# Altium project SaltBattery.PrjPcb
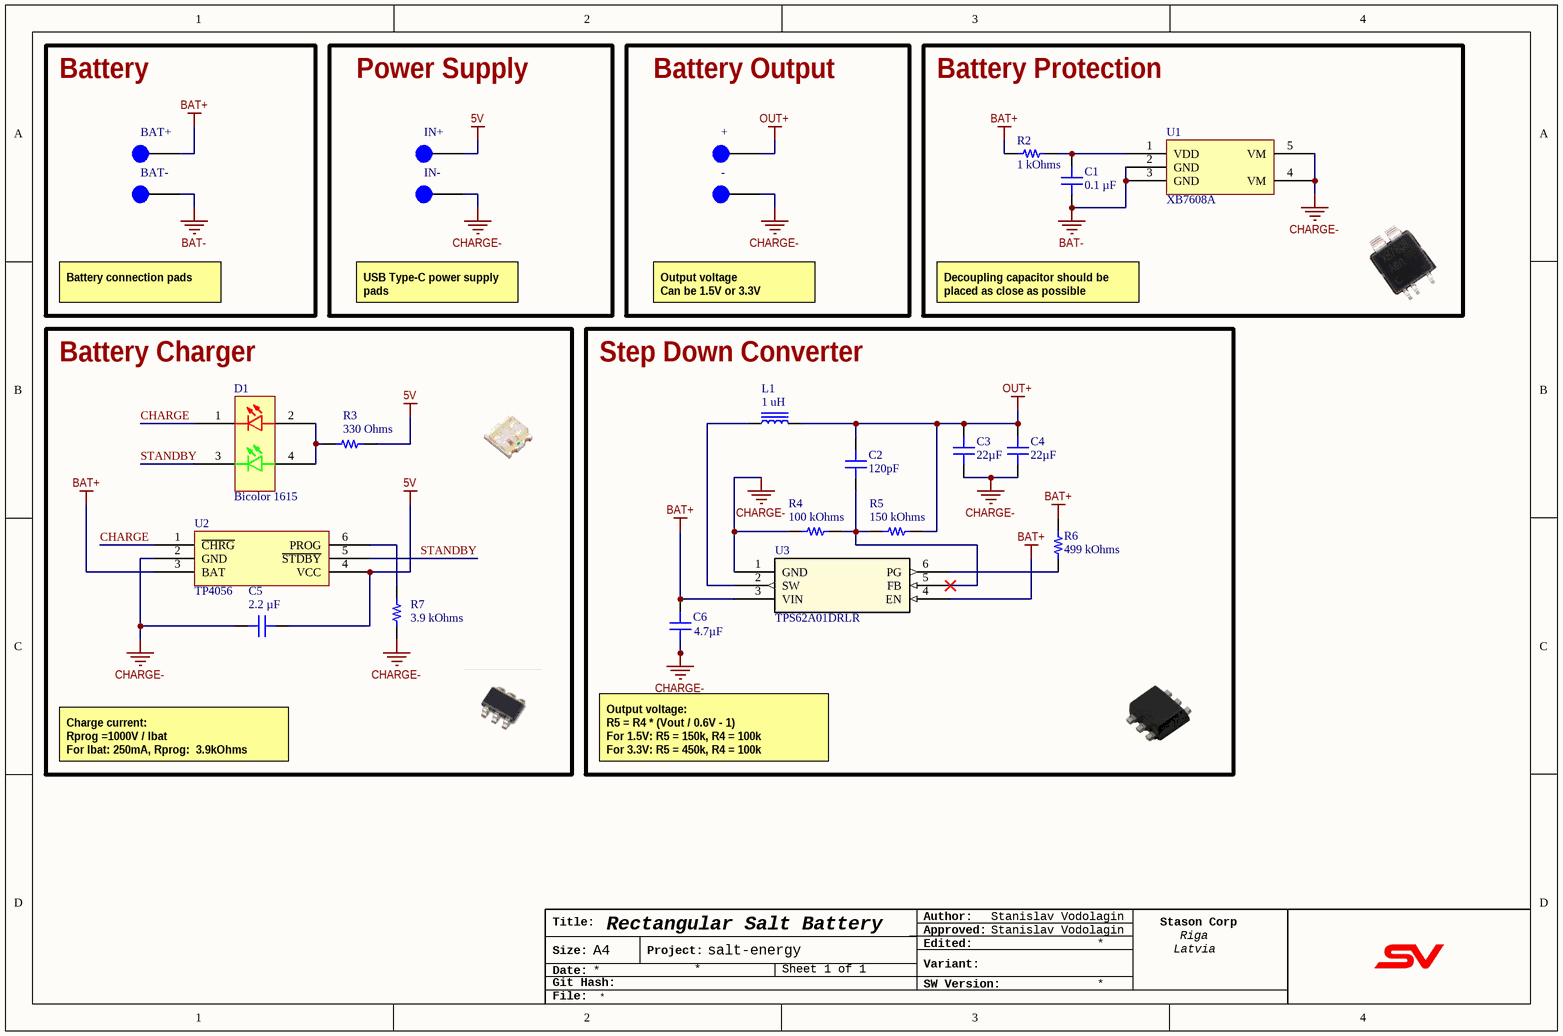
[diagram p0: main.SchDoc]
1 sheet, 23 parts. Net scope: global (net labels, ports and power ports of the same name join across sheets).
Board file: PCB.PcbDoc

## Sheet main.SchDoc: Rectangular Salt Battery
size A4; ApprovedBy: Stanislav Vodolagin; Author: Stanislav Vodolagin; CompanyName: Stason Corp; Organization: Stason Corp; Address1: Riga; Address2: Latvia; SheetNumber: 1; SheetTotal: 1; ProjectTitle: salt-energy

### Parts
+  2MMx2.5MM  [PAD_WITHOUT_HOLE_2X2.5MM]  (value not drawn)  (no BOM)
-  2MMx2.5MM  [PAD_WITHOUT_HOLE_2X2.5MM]  (value not drawn)  (no BOM)
BAT+  2MMx2.5MM  [PAD_WITHOUT_HOLE_2X2.5MM]  (value not drawn)  (no BOM)
BAT-  2MMx2.5MM  [PAD_WITHOUT_HOLE_2X2.5MM]  (value not drawn)  (no BOM)
C1  0.1 µF  [CAP 0805_2012]
C2  120pF  [CAP 0603_1608]
C3  22µF  [CAP 0805_2012]
C4  22µF  [CAP 0805_2012]
C5  2.2 µF  [CAP 0805_2012]
C6  4.7µF  [CAP 0805_2012]
D1  Bicolor 1615  [LED 0603 1615 BICOLOR]
IN+  2MMx2.5MM  [PAD_WITHOUT_HOLE_2X2.5MM]  (value not drawn)  (no BOM)
IN-  2MMx2.5MM  [PAD_WITHOUT_HOLE_2X2.5MM]  (value not drawn)  (no BOM)
L1  1 uH  [TAIYO YUDEN NR4018]
R2  1 kOhms  [RES 0603_1608]
R3  330 Ohms  [RES 0603_1608]
R4  100 kOhms  [RES 0603_1608]
R5  150 kOhms  [RES 0603_1608]
R6  499 kOhms  [RES 0603_1608]
R7  3.9 kOhms  [RES 0603_1608]
U1  XB7608A  [PCB - LEADED - XYSEMI CPC5]
U2  TP4056  [SMD IC SOT-23-6]
U3  TPS62A01DRLR  [TI SOT-563 DRL]

### Blocks framed on the sheet
Battery: BAT+ BAT-
Power Supply: IN+ IN-
Battery Output: + -
Battery Protection: C1 R2 U1
Battery Charger: C5 D1 R3 R7 U2
Step Down Converter: C2-C4 C6 L1 R4-R6 U3

### Nets
5V: C5.2 IN+.1 R3.2 U2.4(VCC)
BAT+: BAT+.1 C6.2 R2.2 R6.2 U2.3(BAT) U3.3(VIN) U3.4(EN)
BAT-: BAT-.1 C1.1 U1.2(GND) U1.3(GND)
CHARGE-: -.1 C3.1 C4.1 C5.1 C6.1 IN-.1 R4.2 R7.1 U1.4(VM) U1.5(VM) U2.2(GND) U3.1(GND)
OUT+: +.1 C2.2 C3.2 C4.2 L1.2 R5.1
CHARGE: D1.1 U2.1(~{CHRG})
STANDBY: D1.3 U2.5(~{STDBY})
NetC1_2: C1.2 R2.1 U1.1(VDD)
NetC2_1: C2.1 R4.1 R5.2 U3.5(FB)
NetD1_2: D1.2 D1.4 R3.1
NetL1_1: L1.1 U3.2(SW)
NetR6_1: R6.1 U3.6(PG)
NetR7_2: R7.2 U2.6(PROG)

### Notes on the sheet
- Battery connection pads
- USB Type-C power supply pads
- Output voltage
  Can be 1.5V or 3.3V
- Decoupling capacitor should be placed as close as possible
- Charge current:
  Rprog =1000V / Ibat
  For Ibat: 250mA, Rprog:  3.9kOhms
- Output voltage:
  R5 = R4 * (Vout / 0.6V - 1)
  For 1.5V: R5 = 150k, R4 = 100k
  For 3.3V: R5 = 450k, R4 = 100k
- Title:
- Author:
- Approved:
- Size:
- Date:
- Git Hash:
- A4
- Project:
- SW Version:
- Variant:
- Edited:
- File:

### Library data of the parts
+ - BAT+ BAT- IN+ IN- = PAD_WITHOUT_HOLE_3X3.5MM: High: 3mm Length: 3.5mm
C1 = VJ0805Y104KFAAT: SMT Capacitor; manufacturer: Vishay Vitramon; id: 199; Temperature Coefficient: X7R; Tolerance: ±10%; Voltage - Rated: 50V; Part Number: VJ0805Y104KFAAT; value: 0.1 µF; Supplier Part Number 1: 720-1753-1-ND; componentlink2description: DigiKey Link; componentlink1url: http://www.vishay.com/docs/45199/vjcommercialseries.pdf; partid: 3420; Supplier 1: DigiKey; series: VJ; lastupdated: 2023-01-03T20:10:53.590; Part Status: Active; Capacitance: 0.1 µF; Device Package: 0805 (2012 Metric); Thickness (Max): 0.057" (1.45mm); Minimum Order: 1; packaging: TapeAndReel; Applications: General Purpose; Package / Case: 0805 (2012 Metric); componentlink1description: Datasheet; price: 0.16; componentlink2url: https://www.digikey.com/en/products/detail/vishay-vitramon/VJ0805Y104KFAAT/8311061; Lifecycle Status: Active; Operating Temperature: -55°C ~ 150°C; Size / Dimension: 0.079" L x 0.049" W (2.00mm x 1.25mm); Mounting Type: Surface Mount, MLCC
C2 = 06031A121KAT2A: SMT Capacitor; manufacturer: AVX Corporation; id: 955; Temperature Coefficient: C0G, NP0; Tolerance: ±10%; Voltage - Rated: 100V; Part Number: 06031A121KAT2A; value: 120pF; Supplier Part Number 1: 478-6023-1-ND; componentlink2description: DigiKey Link; componentlink1url: http://datasheets.avx.com/C0GNP0-Dielectric.pdf; partid: 6218; Supplier 1: DigiKey; series: -; lastupdated: 2020-09-02T01:03:28.977; Part Status: Active; Capacitance: 120pF; Device Package: 0603 (1608 Metric); Thickness (Max): 0.035" (0.90mm); Minimum Order: 1; packaging: TapeAndReel; Applications: General Purpose; Package / Case: 0603 (1608 Metric); componentlink1description: Datasheet; price: 0.04; componentlink2url: http://digikey.com/product-detail/en/avx-corporation/06031A121KAT2A/478-6023-1-ND/2208937; Lifecycle Status: Active; Operating Temperature: -55°C ~ 125°C; Size / Dimension: 0.063" L x 0.032" W (1.60mm x 0.81mm); Mounting Type: Surface Mount, MLCC
C3 C4 = 08056D226KAT2A: SMT Capacitor; manufacturer: AVX Corporation; id: 197; Temperature Coefficient: X5R; Tolerance: ±10%; Voltage - Rated: 6.3V; Part Number: 08056D226KAT2A; value: 22µF; Supplier Part Number 1: 478-10069-1-ND; componentlink2description: DigiKey Link; componentlink1url: http://datasheets.avx.com/cx5r.pdf; partid: 3404; Supplier 1: DigiKey; series: -; lastupdated: 2020-09-02T01:04:40.007; Part Status: Active; Capacitance: 22µF; Device Package: 0805 (2012 Metric); Thickness (Max): 0.060" (1.52mm); Minimum Order: 1; packaging: TapeAndReel; Applications: General Purpose; Package / Case: 0805 (2012 Metric); componentlink1description: Datasheet; price: 0.18; componentlink2url: http://digikey.com/product-detail/en/avx-corporation/08056D226KAT2A/478-10069-1-ND/6564291; Lifecycle Status: Active; Operating Temperature: -55°C ~ 85°C; Size / Dimension: 0.079" L x 0.049" W (2.01mm x 1.25mm); Mounting Type: Surface Mount, MLCC
C5 = GCM21BR71E225KA73K: SMT Capacitor; manufacturer: Murata Electronics; id: 682; Temperature Coefficient: X7R; Tolerance: ±10%; Voltage - Rated: 25V; Part Number: GCM21BR71E225KA73K; value: 2.2 µF; Supplier Part Number 1: 490-14744-1-ND; componentlink2description: DigiKey Link; componentlink1url: https://search.murata.co.jp/Ceramy/image/img/A01X/G101/ENG/GCM21BR71E225KA73-01.pdf; partid: 6110; Supplier 1: DigiKey; series: GCM; lastupdated: 2023-01-03T20:10:47.513; Part Status: Active; Capacitance: 2.2 µF; Device Package: 0805 (2012 Metric); Ratings: AEC-Q200; Thickness (Max): 0.055" (1.40mm); Minimum Order: 1; packaging: TapeAndReel; Applications: Automotive; Package / Case: 0805 (2012 Metric); componentlink1description: Datasheet; price: 0.06; componentlink2url: https://www.digikey.com/en/products/detail/murata-electronics/GCM21BR71E225KA73K/2592259; Lifecycle Status: Active; Operating Temperature: -55°C ~ 125°C; Size / Dimension: 0.079" L x 0.049" W (2.00mm x 1.25mm); Mounting Type: Surface Mount, MLCC
C6 = 0805ZD475KAT2A: SMT Capacitor; manufacturer: AVX Corporation; id: 128; Temperature Coefficient: X5R; Tolerance: ±10%; Voltage - Rated: 10V; Part Number: 0805ZD475KAT2A; value: 4.7µF; Supplier Part Number 1: 478-1415-1-ND; componentlink2description: DigiKey Link; componentlink1url: http://datasheets.avx.com/cx5r.pdf; partid: 3139; Supplier 1: DigiKey; series: -; lastupdated: 2020-09-02T01:04:40.453; Part Status: Active; Capacitance: 4.7µF; Device Package: 0805 (2012 Metric); Thickness (Max): 0.055" (1.40mm); Minimum Order: 1; packaging: TapeAndReel; Applications: General Purpose; Package / Case: 0805 (2012 Metric); componentlink1description: Datasheet; price: 0.12; componentlink2url: http://digikey.com/product-detail/en/avx-corporation/0805ZD475KAT2A/478-1415-1-ND/564447; Lifecycle Status: Active; Operating Temperature: -55°C ~ 85°C; Size / Dimension: 0.079" L x 0.049" W (2.01mm x 1.25mm); Mounting Type: Surface Mount, MLCC
D1 = LED 0603 1615: SMD SMT Light Emitting Diode 1.6*0.8*0.6MM; ComponentLink1Description: Aliexpress; ComponentLink1URL: https://www.aliexpress.com/item/4001174921701.html?spm=a2g0o.order_list.0.0.12d31802vfu5Sp
L1 = NR4018T150M: FIXED IND 1UH 650MA 300MOHM SMD; Manufacturer: Taiyo Yuden; id: 3749; Frequency - Self Resonant: 19MHz; Inductance: 15 µH; Tolerance: ±20%; Type: Drum Core, Wirewound; Inductance Frequency - Test: 100 kHz; Material - Core: Ferrite; DC Resistance (DCR): 300mOhm Max; Value: 15 µH; Shielding: Shielded; Part Number: NR4018T150M; Height - Seated (Max): 0.071" (1.80mm); Supplier Part Number 1: 587-NR4018T150MCT-ND; Current Rating (Amps): 650 mA; ComponentLink1Description: Datasheet; ComponentLink2URL: https://www.digikey.com/en/products/detail/taiyo-yuden/NR4018T150M/1171820; ComponentLink1URL: https://www.yuden.co.jp/productdata/catalog/wound04_e.pdf; Supplier 1: DigiKey; Series: NR; Part Status: Active; ComponentLink2Description: DigiKey Link; Packaging: TapeAndReel; Minimum Order: 1; PartId: 3777; Lifecycle Status: Active; LastUpdated: 2023-01-02T21:11:24.473; Operating Temperature: -25°C ~ 120°C; Size / Dimension: 0.157" L x 0.157" W (4.00mm x 4.00mm); Mounting Type: Surface Mount; Price: 0.13
R2 = ERJ-U3RD1001V: RES 1K OHM 0.5% 1/10W 0603 SMD; Manufacturer: Panasonic Electronic Components; id: 17229; Temperature Coefficient: ±50ppm/°C; Power (Watts): 0.1W, 1/10W; Part Number: ERJ-U3RD1001V; Height - Seated (Max): 0.022" (0.55mm); Supplier Part Number 1: 10-ERJ-U3RD1001VCT-ND; Supplier Device Package: 0603; ComponentLink1Description: Datasheet; ComponentLink2URL: https://www.digikey.com/en/products/detail/panasonic-electronic-components/ERJ-U3RD1001V/12549507; Features: Anti-Sulfur, Automotive AEC-Q200; ComponentLink1URL: https://industrial.panasonic.com/cdbs/www-data/pdf/RDP0000/RDP0000C343.pdf; Composition: Thick Film; Tolerance: ±0.5%; Supplier 1: DigiKey; Series: ERJ-U3R; Part Status: Active; ComponentLink2Description: DigiKey Link; Device Package: 0603 (1608 Metric); Packaging: TapeAndReel; Ratings: AEC-Q200; Minimum Order: 1; Package / Case: 0603 (1608 Metric); PartId: 69166; Lifecycle Status: Active; LastUpdated: 2023-01-02T20:27:49.777; Operating Temperature: -55°C ~ 155°C; Number of Terminations: 2; Value: 1 kOhms; Size / Dimension: 0.063" L x 0.031" W (1.60mm x 0.80mm); Price: 0.03; Resistance: 1 kOhms
R3 = ERA-3AEB331V: RES SMD 330 OHM 0.1% 1/10W 0603; Manufacturer: Panasonic Electronic Components; id: 331; Temperature Coefficient: ±25ppm/°C; Power (Watts): 0.1W, 1/10W; Part Number: ERA-3AEB331V; Height - Seated (Max): 0.022" (0.55mm); Supplier Part Number 1: P330DBCT-ND; Supplier Device Package: 0603; ComponentLink1Description: Datasheet; ComponentLink2URL: https://www.digikey.com/en/products/detail/panasonic-electronic-components/ERA-3AEB331V/1465842; Features: Automotive AEC-Q200; ComponentLink1URL: https://industrial.panasonic.com/cdbs/www-data/pdf/RDM0000/AOA0000C307.pdf; Composition: Thin Film; Tolerance: ±0.1%; Supplier 1: DigiKey; Series: ERA-3A; Part Status: Active; ComponentLink2Description: DigiKey Link; Device Package: 0603 (1608 Metric); Packaging: TapeAndReel; Ratings: AEC-Q200; Minimum Order: 1; Package / Case: 0603 (1608 Metric); PartId: 5565; Lifecycle Status: Active; LastUpdated: 2023-01-02T20:30:24.253; Operating Temperature: -55°C ~ 155°C; Number of Terminations: 2; Value: 330 Ohms; Size / Dimension: 0.063" L x 0.031" W (1.60mm x 0.80mm); Price: 0.03; Resistance: 330 Ohms
R4 = ERJ-U03J104V: RES 100K OHM 5% 1/10W 0603 SMD; Manufacturer: Panasonic Electronic Components; id: 16727; Temperature Coefficient: ±200ppm/°C; Power (Watts): 0.1W, 1/10W; Part Number: ERJ-U03J104V; Height - Seated (Max): 0.022" (0.55mm); Supplier Part Number 1: 10-ERJ-U03J104VCT-ND; Supplier Device Package: 0603; ComponentLink1Description: Datasheet; ComponentLink2URL: https://www.digikey.com/en/products/detail/panasonic-electronic-components/ERJ-U03J104V/11635952; Features: Anti-Sulfur, Automotive AEC-Q200; ComponentLink1URL: https://industrial.panasonic.com/cdbs/www-data/pdf/RDP0000/AOA0000C334.pdf; Composition: Thick Film; Tolerance: ±5%; Supplier 1: DigiKey; Series: ERJ-U03; Part Status: Active; ComponentLink2Description: DigiKey Link; Device Package: 0603 (1608 Metric); Packaging: TapeAndReel; Ratings: AEC-Q200; Minimum Order: 1; Package / Case: 0603 (1608 Metric); PartId: 67627; Lifecycle Status: Active; LastUpdated: 2023-01-02T20:27:56.093; Operating Temperature: -55°C ~ 155°C; Number of Terminations: 2; Value: 100 kOhms; Size / Dimension: 0.063" L x 0.031" W (1.60mm x 0.80mm); Price: 0.01; Resistance: 100 kOhms
R5 = ERJ-H3ED1503V: RES 150K OHM 0.5% 1/6W 0603; Manufacturer: Panasonic Electronic Components; id: 15235; Temperature Coefficient: ±100ppm/°C; Power (Watts): 0.125W, 1/8W; Part Number: ERJ-H3ED1503V; Height - Seated (Max): 0.022" (0.55mm); Supplier Part Number 1: 10-ERJ-H3ED1503VCT-ND; Supplier Device Package: 0603; ComponentLink1Description: Datasheet; ComponentLink2URL: https://www.digikey.com/en/products/detail/panasonic-electronic-components/ERJ-H3ED1503V/13878124; Features: Automotive AEC-Q200; ComponentLink1URL: https://b2b-api.panasonic.eu/file_stream/pids/fileversion/236250; Composition: Thick Film; Tolerance: ±0.5%; Supplier 1: DigiKey; Series: ERJ-H3E; Part Status: Active; ComponentLink2Description: DigiKey Link; Device Package: 0603 (1608 Metric); Packaging: TapeAndReel; Ratings: AEC-Q200; Minimum Order: 1; Package / Case: 0603 (1608 Metric); PartId: 63770; Lifecycle Status: Active; LastUpdated: 2023-01-02T20:28:19.700; Operating Temperature: -55°C ~ 175°C; Number of Terminations: 2; Value: 150 kOhms; Size / Dimension: 0.063" L x 0.031" W (1.60mm x 0.80mm); Price: 0.04; Resistance: 150 kOhms
R6 = ERJ-3EKF4993V: RES SMD 499K OHM 1% 1/10W 0603; Manufacturer: Panasonic Electronic Components; id: 9264; Temperature Coefficient: ±100ppm/°C; Power (Watts): 0.1W, 1/10W; Part Number: ERJ-3EKF4993V; Height - Seated (Max): 0.022" (0.55mm); Supplier Part Number 1: P499KHCT-ND; Supplier Device Package: 0603; ComponentLink1Description: Datasheet; ComponentLink2URL: https://www.digikey.com/en/products/detail/panasonic-electronic-components/ERJ-3EKF4993V/196382; Features: Automotive AEC-Q200; ComponentLink1URL: https://industrial.panasonic.com/cdbs/www-data/pdf/RDA0000/AOA0000C304.pdf; Composition: Thick Film; Tolerance: ±1%; Supplier 1: DigiKey; Series: ERJ-3EK; Part Status: Active; ComponentLink2Description: DigiKey Link; Device Package: 0603 (1608 Metric); Packaging: TapeAndReel; Ratings: AEC-Q200; Minimum Order: 1; Package / Case: 0603 (1608 Metric); PartId: 23062; Lifecycle Status: Active; LastUpdated: 2023-01-02T20:29:07.173; Operating Temperature: -55°C ~ 155°C; Number of Terminations: 2; Value: 499 kOhms; Size / Dimension: 0.063" L x 0.031" W (1.60mm x 0.80mm); Price: 0.01; Resistance: 499 kOhms
R7 = ERJ-3GEYJ392V: RES SMD 3.9K OHM 5% 1/10W 0603; Manufacturer: Panasonic Electronic Components; id: 7011; Temperature Coefficient: ±200ppm/°C; Power (Watts): 0.1W, 1/10W; Part Number: ERJ-3GEYJ392V; Height - Seated (Max): 0.022" (0.55mm); Supplier Part Number 1: P3.9KGCT-ND; Supplier Device Package: 0603; ComponentLink1Description: Datasheet; ComponentLink2URL: https://www.digikey.com/en/products/detail/panasonic-electronic-components/ERJ-3GEYJ392V/135900; Features: Automotive AEC-Q200; ComponentLink1URL: http://industrial.panasonic.com/www-cgi/jvcr13pz.cgi?E+PZ+3+AOA0001+ERJ3GEYJ392V+7+WW; Composition: Thick Film; Tolerance: ±5%; Supplier 1: DigiKey; Series: ERJ-3G; Part Status: Active; ComponentLink2Description: DigiKey Link; Device Package: 0603 (1608 Metric); Packaging: TapeAndReel; Ratings: AEC-Q200; Minimum Order: 1; Package / Case: 0603 (1608 Metric); PartId: 19216; Lifecycle Status: Active; LastUpdated: 2023-01-02T20:29:27.293; Operating Temperature: -55°C ~ 155°C; Number of Terminations: 2; Value: 3.9 kOhms; Size / Dimension: 0.063" L x 0.031" W (1.60mm x 0.80mm); Price: 0.01; Resistance: 3.9 kOhms
U1 = XB7608A: CPC-5 Battery Management IC
U2 = TP4057: 500mA Linear Li-Ion Battery Charger; ComponentLink1Description: Datasheet; ComponentLink1URL: https://pdf1.alldatasheet.com/datasheet-pdf/view/1134940/TPOWER/TP4057.html
U3 = TPS62A01DRLR: 2.5-V to 5.5-V input, 1-A high-efficiency step-down converter with forced PWM in SOT-563 package; Mfr_Name: Texas Instruments; Copyright: Copyright (C) 2022 Ultra Librarian. All rights reserved.; Manufacturer_Part_Number: TPS62A01DRLR; RefDes: RefDes; Type: DEV; ComponentLink1Description: Datasheet; ComponentLink1URL: https://www.ti.com/document-viewer/TPS62A01A/datasheet/GUID-583A9EFF-0876-4B6A-9171-86BE16EA9829#GUID-016A0F07-62BF-4703-9B43-9200616E2C9F